# Altium schematic sheet Nucleo_H743ZI.SchDoc: {Наименование}
size 420 x 297 mm; DocumentNumber: НРДЦ.ХХХХХХ.ХХХ ХХ; SheetNumber: 3; SheetTotal: 3; PageSetup: Record=PageOptions|CenterHorizontal=False|CenterVertical=False|PrintScale=0.95|XCorrection=0.00|YCorrection=0.00|PrintKind=1|BorderSize=5000000|LeftOffset=0|BottomOffset=0|Orientation=1|PaperLength=1000|PaperWidth=1000|Scale=100|PaperSource=15|PrintQuality=600|MediaType=1|DitherType=10|PaperKind=A4|PrintScaleMode=1; Rule: PcbType=ProtelPcb
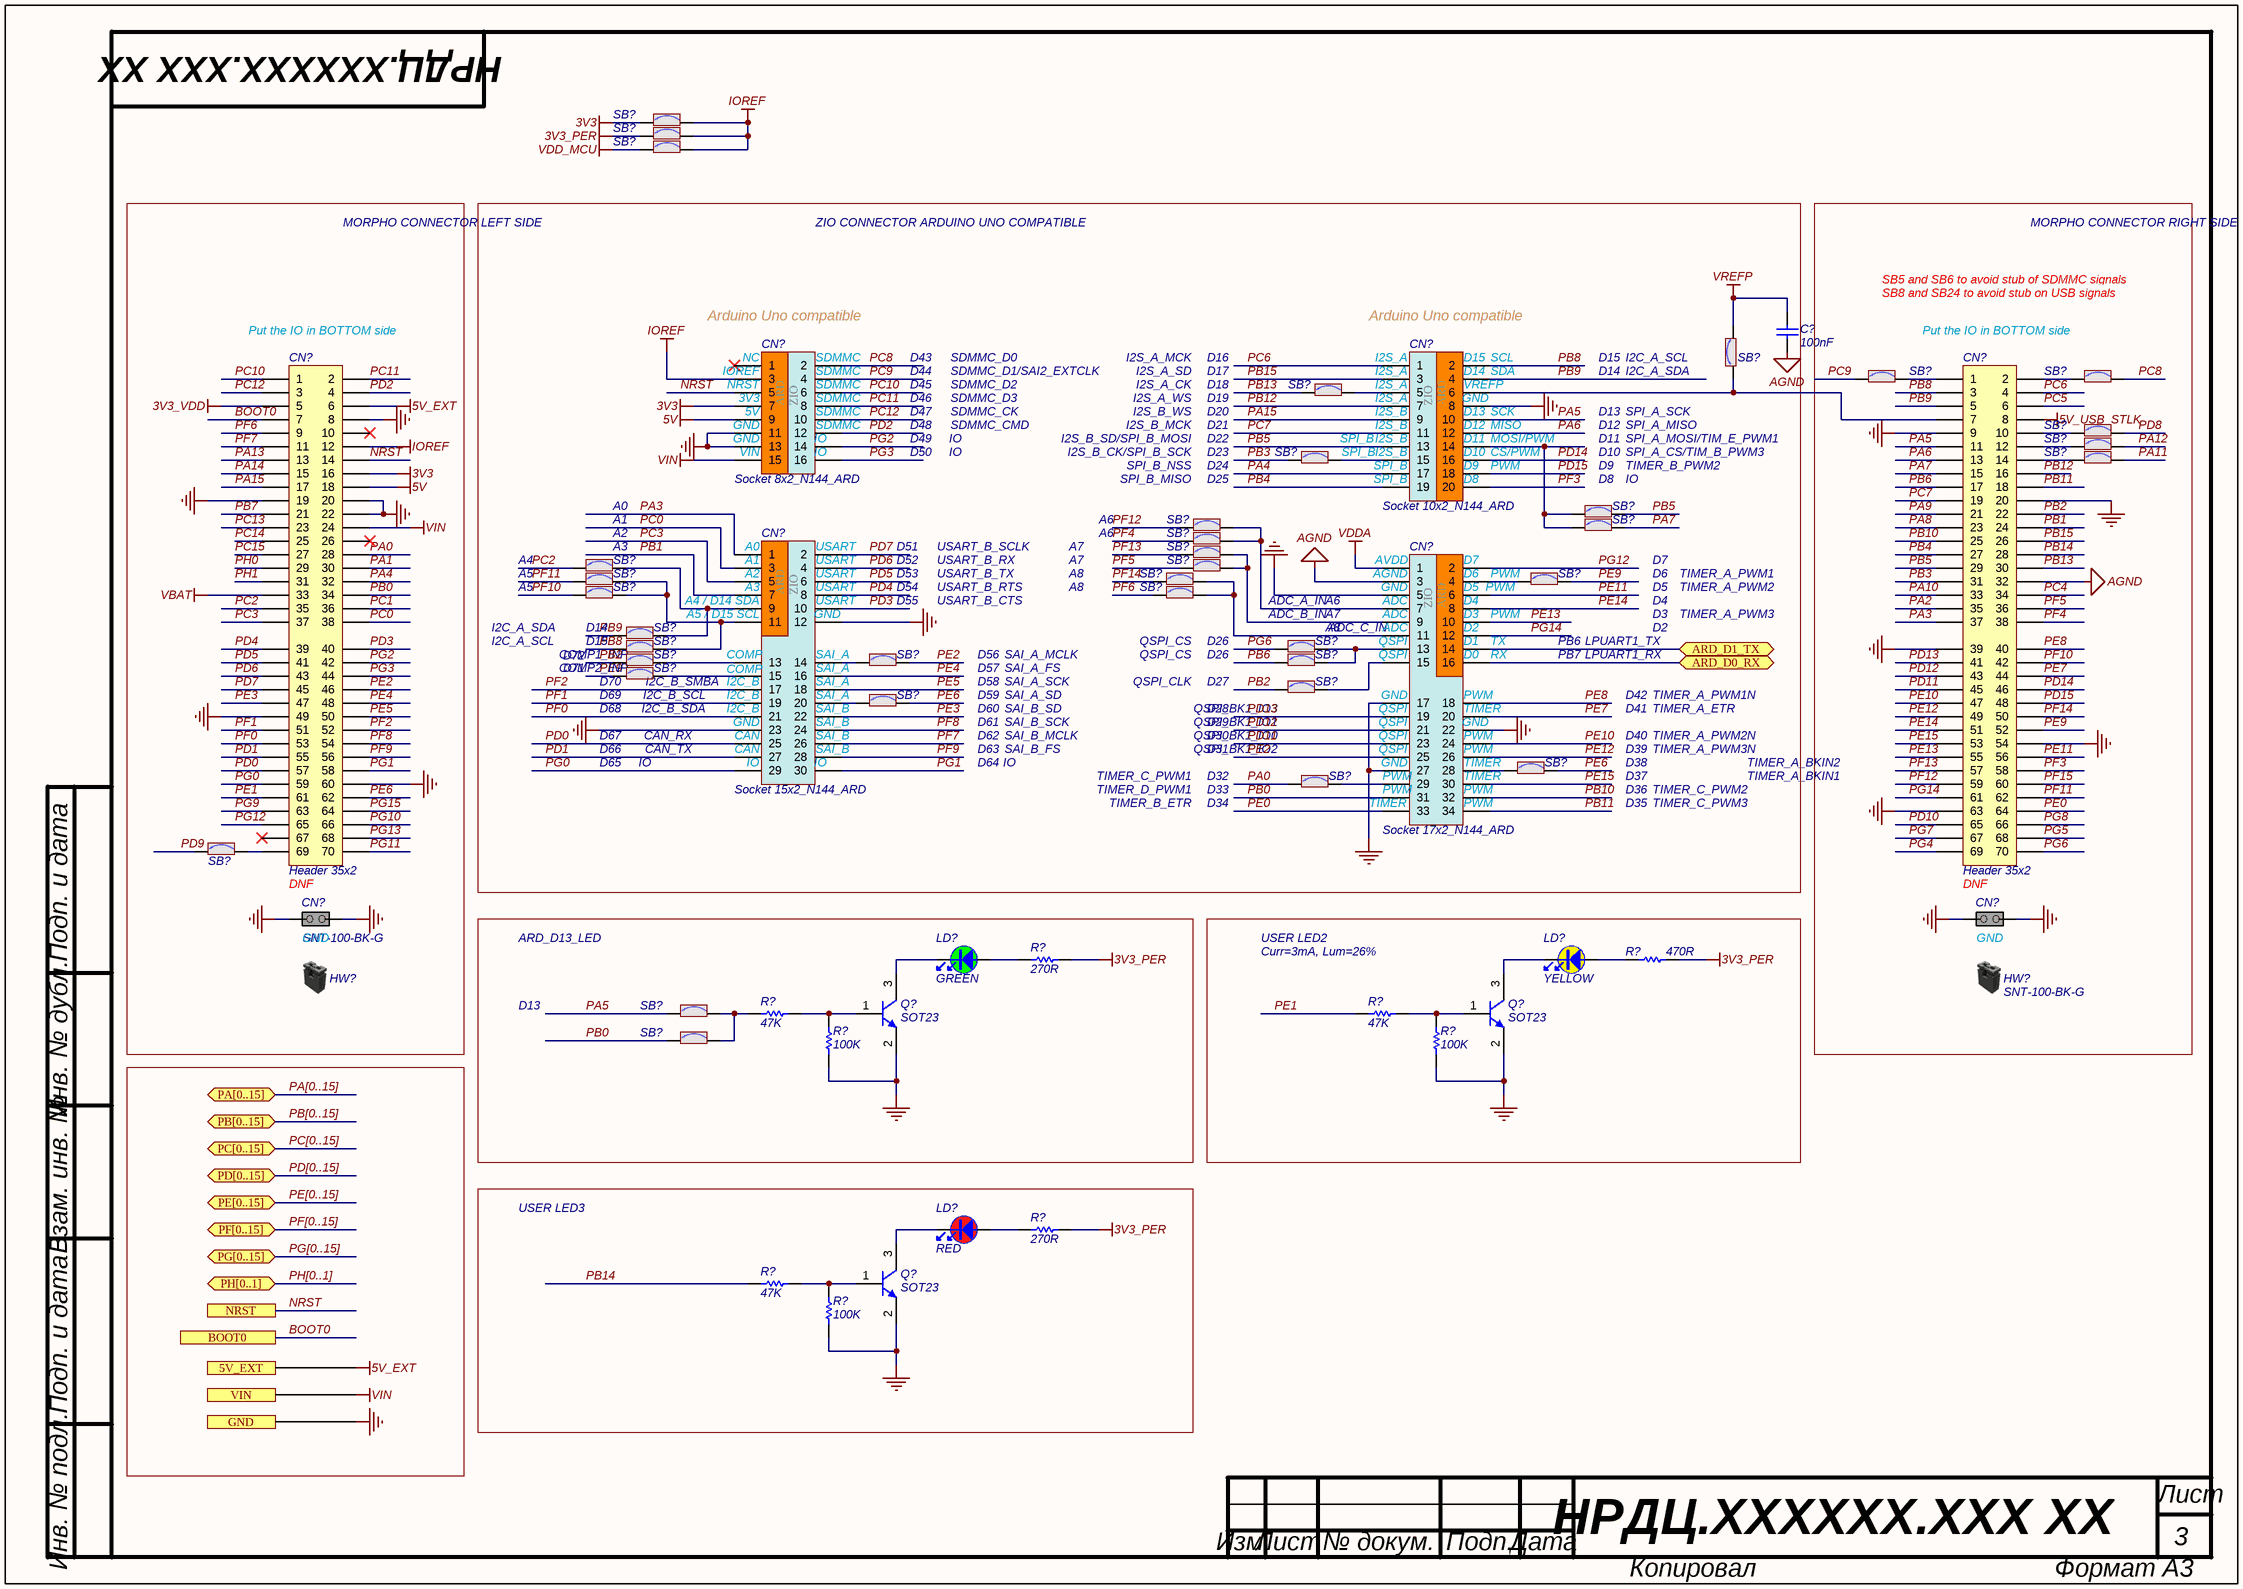
[diagram p0: Nucleo_H743ZI.SchDoc]

## Parts
(Parts that share a designator on the sheet are numbered #1, #2 ... from top to bottom, then left to right.)
C?  value 100nF  [C0603]  (hidden comment: Capacitor)
CN?#1  Socket 8x2_N144_ARD  [CON_SAMTEC_SSW-108-23-X-D_N144_ARD]
CN?#2  Socket 10x2_N144_ARD  [CON_SAMTEC_SSW-110-23-X-D_N144_ARD]
CN?#3  Header 35x2  [CON_SAMTEC_TSW-135-07-X-D]
CN?#4  Header 35x2  [CON_SAMTEC_TSW-135-07-X-D]
CN?#5  Socket 15x2_N144_ARD  [CON_SAMTEC_SSW-115-23-X-D_N144_ARD]
CN?#6  Socket 17x2_N144_ARD  [CON_SAMTEC_SSW-117-23-X-D_N144_ARD]
CN?#7  Jumper_Header 2x1  [CON_SAMTEC_TSW-102-09-X-S]  (value not drawn)
CN?#8  Jumper_Header 2x1  [CON_SAMTEC_TSW-102-09-X-S]  (value not drawn)
HW?#1  value SNT-100-BK-G  (hidden comment: Shunt Black 2.54mm)  (mechanical)
HW?#2  value SNT-100-BK-G  (hidden comment: Shunt Black 2.54mm)  (mechanical)
LD?#1  value GREEN  [LED_0603_OSRAM_LG-Q396-PS-35_GREEN_1A2K_H0P4]  (hidden comment: LED_green)
LD?#2  value YELLOW  [LED_0603_OSRAM_LY-Q396-P1Q2-36_YELLOW_1A2K_H0P4]  (hidden comment: LED_yellow)
LD?#3  value RED  [LED_0603_OSRAM_LS-Q976-NR-1_RED_1A2K_H0P8]  (hidden comment: LED_red)
Q?#1  value SOT23  [NPN_SOT23]  (hidden comment: 9013-SOT23)
Q?#2  value SOT23  [NPN_SOT23]  (hidden comment: 9013-SOT23)
Q?#3  value SOT23  [NPN_SOT23]  (hidden comment: 9013-SOT23)
R?#1  value 270R  [R0402]  (hidden comment: Resistor)
R?#2  value 470R  [R0402]  (hidden comment: Resistor)
R?#3  value 47K  [R0603]  (hidden comment: Resistor)
R?#4  value 47K  [R0603]  (hidden comment: Resistor)
R?#5  value 100K  [R0603]  (hidden comment: Resistor)
R?#6  value 100K  [R0603]  (hidden comment: Resistor)
R?#7  value 270R  [R0402]  (hidden comment: Resistor)
R?#8  value 47K  [R0603]  (hidden comment: Resistor)
R?#9  value 100K  [R0603]  (hidden comment: Resistor)
SB?#1  SB_ON  [SOLDER-BRIDGE_R0603-0R]  (value not drawn)
SB?#2  SB_ON  [SOLDER-BRIDGE_R0603-0R]  (value not drawn)
SB?#3  SB_ON  [SOLDER-BRIDGE_R0603-0R]  (value not drawn)
SB?#4  SB_ON  [SOLDER-BRIDGE_R0603-0R]  (value not drawn)
SB?#5  SB_ON  [SOLDER-BRIDGE_R0603-0R]  (value not drawn)
SB?#6  SB_ON  [SOLDER-BRIDGE_R0603-0R]  (value not drawn)
SB?#7  SB_ON  [SOLDER-BRIDGE_R0603-0R]  (value not drawn)
SB?#8  SB_ON  [SOLDER-BRIDGE_R0402-0R]  (value not drawn)
SB?#9  SB_ON  [SOLDER-BRIDGE_R0603-0R]  (value not drawn)
SB?#10  SB_ON  [SOLDER-BRIDGE_R0603-0R]  (value not drawn)
SB?#11  SB_ON  [SOLDER-BRIDGE_R0603-0R]  (value not drawn)
SB?#12  SB_ON  [SOLDER-BRIDGE_R0603-0R]  (value not drawn)
SB?#13  SB_ON  [SOLDER-BRIDGE_R0402-0R]  (value not drawn)
SB?#14  SB_ON  [SOLDER-BRIDGE_R0603-0R]  (value not drawn)
SB?#15  SB_ON  [SOLDER-BRIDGE_R0402-0R]  (value not drawn)
SB?#16  SB_ON  [SOLDER-BRIDGE_R0402-0R]  (value not drawn)
SB?#17  SB_ON  [SOLDER-BRIDGE_R0402-0R]  (value not drawn)
SB?#18  SB_ON  [SOLDER-BRIDGE_R0402-0R]  (value not drawn)
SB?#19  SB_ON  [SOLDER-BRIDGE_R0402-0R]  (value not drawn)
SB?#20  SB_ON  [SOLDER-BRIDGE_R0402-0R]  (value not drawn)
SB?#21  SB_ON  [SOLDER-BRIDGE_R0402-0R]  (value not drawn)
SB?#22  SB_ON  [SOLDER-BRIDGE_R0402-0R]  (value not drawn)
SB?#23  SB_ON  [SOLDER-BRIDGE_R0402-0R]  (value not drawn)
SB?#24  SB_ON  [SOLDER-BRIDGE_R0402-0R]  (value not drawn)
SB?#25  SB_ON  [SOLDER-BRIDGE_R0402-0R]  (value not drawn)
SB?#26  SB_ON  [SOLDER-BRIDGE_R0402-0R]  (value not drawn)
SB?#27  SB_ON  [SOLDER-BRIDGE_R0402-0R]  (value not drawn)
SB?#28  SB_ON  [SOLDER-BRIDGE_R0402-0R]  (value not drawn)
SB?#29  SB_ON  [SOLDER-BRIDGE_R0402-0R]  (value not drawn)
SB?#30  SB_ON  [SOLDER-BRIDGE_R0402-0R]  (value not drawn)
SB?#31  SB_ON  [SOLDER-BRIDGE_R0402-0R]  (value not drawn)
SB?#32  SB_ON  [SOLDER-BRIDGE_R0402-0R]  (value not drawn)
SB?#33  SB_ON  [SOLDER-BRIDGE_R0402-0R]  (value not drawn)
SB?#34  SB_ON  [SOLDER-BRIDGE_R0402-0R]  (value not drawn)
SB?#35  SB_ON  [SOLDER-BRIDGE_R0402-0R]  (value not drawn)
SB?#36  SB_ON  [SOLDER-BRIDGE_R0603-0R]  (value not drawn)
SB?#37  SB_ON  [SOLDER-BRIDGE_R0603-0R]  (value not drawn)

## Blocks framed on the sheet
USER LED3: LD?#3 Q?#3 R?#7-R?#9

## Ports
5V_EXT, ARD_D0_RX (bidir), ARD_D1_TX (bidir), BOOT0, GND, NRST, PA[0..15] (bidir), PB[0..15] (bidir), PC[0..15] (bidir), PD[0..15] (bidir), PE[0..15] (bidir), PF[0..15] (bidir), PG[0..15] (bidir), PH[0..1] (bidir), VIN

## Nets
3V3: CN?#1.7 CN?#3.16 SB?#1.1
3V3_PER: R?#1.2 R?#2.2 R?#7.2 SB?#2.1
3V3_VDD: CN?#3.5
5V: CN?#1.9 CN?#3.18
5V_EXT: CN?#3.6 ; port 5V_EXT
5V_USB_STLK: CN?#4.8
AGND: C?.1 CN?#4.32 CN?#6.3
GND: CN?#1.11 CN?#1.13 CN?#2.8 CN?#3.8 CN?#3.19 CN?#3.20 CN?#3.22 CN?#3.49 CN?#3.60 CN?#4.9 CN?#4.20 CN?#4.39 CN?#4.54 CN?#4.63 CN?#5.12 CN?#5.23 CN?#6.5 CN?#6.17 CN?#6.22 CN?#6.27 CN?#7.1(COMMON) CN?#7.2(NO) CN?#8.1(COMMON) CN?#8.2(NO) Q?#1.2(E) Q?#2.2(E) Q?#3.2(E) R?#5.1 R?#6.1 R?#9.1 ; port GND
IOREF: CN?#1.3 CN?#3.12 SB?#1.2 SB?#2.2 SB?#3.2
VBAT: CN?#3.33
VDD_MCU: SB?#3.1
VDDA: CN?#6.1
VIN: CN?#1.15 CN?#3.24 ; port VIN
VREFP: C?.2 SB?#4.2
ARD_D0_RX: CN?#6.16 ; port ARD_D0_RX
ARD_D1_TX: CN?#6.14 ; port ARD_D1_TX
BOOT0: CN?#3.7 ; port BOOT0
NRST: CN?#1.5 CN?#3.14 ; port NRST
PA0: CN?#3.28 SB?#34.1
PA1: CN?#3.30
PA2: CN?#4.35
PA3: CN?#4.37 CN?#5.1
PA4: CN?#2.17 CN?#3.32
PA5: CN?#2.10 CN?#4.11 SB?#36.1
PA6: CN?#2.12 CN?#4.13
PA7: CN?#4.15 SB?#14.2
PA8: CN?#4.23
PA9: CN?#4.21
PA10: CN?#4.33
PA11: SB?#11.2
PA12: SB?#9.2
PA13: CN?#3.13
PA14: CN?#3.15
PA15: CN?#2.9 CN?#3.17
PB0: CN?#3.34 CN?#6.31 SB?#37.1
PB1: CN?#4.24 CN?#5.7
PB2: CN?#4.22 SB?#27.1 SB?#31.1
PB3: CN?#4.31 SB?#10.1
PB4: CN?#2.19 CN?#4.27
PB5: CN?#2.13 CN?#4.29 SB?#12.2
PB6: CN?#4.17 SB?#29.1
PB7: CN?#3.21
PB8: CN?#2.2 CN?#4.3 SB?#25.1
PB9: CN?#2.4 CN?#4.5 SB?#24.1
PB10: CN?#4.25 CN?#6.32
PB11: CN?#4.18 CN?#6.34
PB12: CN?#2.7 CN?#4.16
PB13: CN?#4.30 SB?#7.1
PB14: CN?#4.28 R?#8.1
PB15: CN?#2.3 CN?#4.26
PC0: CN?#3.38 CN?#5.3
PC1: CN?#3.36
PC2: CN?#3.35 SB?#17.1
PC3: CN?#3.37 CN?#5.5
PC4: CN?#4.34
PC5: CN?#4.6
PC6: CN?#2.1 CN?#4.4
PC7: CN?#2.11 CN?#4.19
PC8: CN?#1.2 SB?#6.2
PC9: CN?#1.4 SB?#5.1
PC10: CN?#1.6 CN?#3.1
PC11: CN?#1.8 CN?#3.2
PC12: CN?#1.10 CN?#3.3
PC13: CN?#3.23
PC14: CN?#3.25
PC15: CN?#3.27
PD0: CN?#3.57 CN?#5.25
PD1: CN?#3.55 CN?#5.27
PD2: CN?#1.12 CN?#3.4
PD3: CN?#3.40 CN?#5.10
PD4: CN?#3.39 CN?#5.8
PD5: CN?#3.41 CN?#5.6
PD6: CN?#3.43 CN?#5.4
PD7: CN?#3.45 CN?#5.2
PD8: SB?#8.2
PD9: SB?#35.1
PD10: CN?#4.65
PD11: CN?#4.45 CN?#6.23
PD12: CN?#4.43 CN?#6.21
PD13: CN?#4.41 CN?#6.19
PD14: CN?#2.16 CN?#4.46
PD15: CN?#2.18 CN?#4.48
PE0: CN?#4.64 CN?#6.33
PE1: CN?#3.61 R?#4.1
PE2: CN?#3.46 CN?#6.25 SB?#28.2
PE3: CN?#3.47 CN?#5.22
PE4: CN?#3.48 CN?#5.16
PE5: CN?#3.50 CN?#5.18
PE6: CN?#3.62 SB?#32.2 SB?#33.2
PE7: CN?#4.44 CN?#6.20
PE8: CN?#4.40 CN?#6.18
PE9: CN?#4.52 SB?#21.2 SB?#30.1
PE10: CN?#4.47 CN?#6.24
PE11: CN?#4.56 CN?#6.6
PE12: CN?#4.49 CN?#6.26
PE13: CN?#4.55 CN?#6.10
PE14: CN?#4.51 CN?#6.8
PE15: CN?#4.53 CN?#6.30
PF0: CN?#3.53 CN?#5.21
PF1: CN?#3.51 CN?#5.19
PF2: CN?#3.52 CN?#5.17
PF3: CN?#2.20 CN?#4.58
PF4: CN?#4.38 SB?#15.1
PF5: CN?#4.36 SB?#18.1
PF6: CN?#3.9 SB?#23.1
PF7: CN?#3.11 CN?#5.26
PF8: CN?#3.54 CN?#5.24
PF9: CN?#3.56 CN?#5.28
PF10: CN?#4.42 SB?#22.1
PF11: CN?#4.62 SB?#19.1
PF12: CN?#4.59 SB?#13.1
PF13: CN?#4.57 SB?#16.1
PF14: CN?#4.50 SB?#20.1
PF15: CN?#4.60
PG0: CN?#3.59 CN?#5.29
PG1: CN?#3.58 CN?#5.30
PG2: CN?#1.14 CN?#3.42
PG3: CN?#1.16 CN?#3.44
PG4: CN?#4.69
PG5: CN?#4.68
PG6: CN?#4.70 SB?#26.1
PG7: CN?#4.67
PG8: CN?#4.66
PG9: CN?#3.63
PG10: CN?#3.66
PG11: CN?#3.70
PG12: CN?#3.65 CN?#6.2
PG13: CN?#3.68
PG14: CN?#4.61 CN?#6.12
PG15: CN?#3.64
PH0: CN?#3.29
PH1: CN?#3.31
NetCN?#2_5: CN?#2.5 SB?#7.2
NetCN?#2_6: CN?#2.6 CN?#4.7 SB?#4.1
NetCN?#2_14: CN?#2.14 SB?#12.1 SB?#14.1
NetCN?#2_15: CN?#2.15 SB?#10.2
NetCN?#3_69: CN?#3.69 SB?#35.2
NetCN?#4_1: CN?#4.1 SB?#5.2
NetCN?#4_2: CN?#4.2 SB?#6.1
NetCN?#4_10: CN?#4.10 SB?#8.1
NetCN?#4_12: CN?#4.12 SB?#9.1
NetCN?#4_14: CN?#4.14 SB?#11.1
NetCN?#5_9: CN?#5.9 SB?#17.2 SB?#24.2
NetCN?#5_11: CN?#5.11 SB?#19.2 SB?#22.2 SB?#25.2
NetCN?#5_13: CN?#5.13 SB?#27.2
NetCN?#5_14: CN?#5.14 SB?#28.1
NetCN?#5_15: CN?#5.15 SB?#30.2
NetCN?#5_20: CN?#5.20 SB?#32.1
NetCN?#6_4: CN?#6.4 SB?#21.1
NetCN?#6_7: CN?#6.7 SB?#13.2 SB?#15.2
NetCN?#6_9: CN?#6.9 SB?#16.2 SB?#18.2
NetCN?#6_11: CN?#6.11 SB?#20.2 SB?#23.2
NetCN?#6_13: CN?#6.13 SB?#26.2 SB?#29.2
NetCN?#6_15: CN?#6.15 SB?#31.2
NetCN?#6_28: CN?#6.28 SB?#33.1
NetCN?#6_29: CN?#6.29 SB?#34.2
NetLD?#1_1: LD?#1.1 R?#1.1
NetLD?#1_2: LD?#1.2 Q?#1.3(C)
NetLD?#2_1: LD?#2.1 R?#2.1
NetLD?#2_2: LD?#2.2 Q?#2.3(C)
NetLD?#3_1: LD?#3.1 R?#7.1
NetLD?#3_2: LD?#3.2 Q?#3.3(C)
NetQ?#1_1: Q?#1.1(B) R?#3.2 R?#5.2
NetQ?#2_1: Q?#2.1(B) R?#4.2 R?#6.2
NetQ?#3_1: Q?#3.1(B) R?#8.2 R?#9.2
NetR?#3_1: R?#3.1 SB?#36.2 SB?#37.2

Not connected (* = marked no-connect by the designer): CN?#1 1*; CN?#3 10* 26* 67*

## Buses and harness runs
bus PA[0..15] = port PA[0..15]
bus PB[0..15] = port PB[0..15]
bus PC[0..15] = port PC[0..15]
bus PD[0..15] = port PD[0..15]
bus PE[0..15] = port PE[0..15]
bus PF[0..15] = port PF[0..15]
bus PG[0..15] = port PG[0..15]
bus PH[0..1] = port PH[0..1]

## Notes on the sheet
- MORPHO CONNECTOR LEFT SIDE
- ZIO CONNECTOR ARDUINO UNO COMPATIBLE
- MORPHO CONNECTOR RIGHT SIDE
- (near CN?#1) Arduino Uno compatible
- (near CN?#2) Arduino Uno compatible
- SB5 and SB6 to avoid stub of SDMMC signals
- SB8 and SB24 to avoid stub on USB signals
- (near CN?#3) Put the IO in BOTTOM side
- (near CN?#1) NC
- (near CN?#1) IOREF
- (near CN?#1) NRST
- (near CN?#1) SDMMC
- D43
- D44
- D45
- SDMMC_D0
- SDMMC_D1/SAI2_EXTCLK
- SDMMC_D2
- I2S_A_SD
- I2S_A_CK
- I2S_A_MCK
- D16
- D17
- D18
- (near CN?#2) I2S_A
- (near CN?#2) VREFP
- (near CN?#2) D14
- (near CN?#2) D15
- (near CN?#2) SCL
- (near CN?#2) SDA
- D15
- D14
- (near SB?#4) I2C_A_SCL
- (near SB?#4) I2C_A_SDA
- Put the IO in BOTTOM side
- (near CN?#1) 3V3
- (near CN?#1) 5V
- (near CN?#1) GND
- (near CN?#1) VIN
- (near CN?#1) IO
- D46
- D47
- D48
- D49
- D50
- SDMMC_CK
- SDMMC_CMD
- SDMMC_D3
- IO
- I2S_A_WS
- I2S_B_SD/SPI_B_MOSI
- I2S_B_CK/SPI_B_SCK
- I2S_B_WS
- I2S_B_MCK
- D19
- D20
- D21
- D22
- D23
- SPI_B
- (near SB?#10) SPI_B
- (near CN?#2) I2S_B
- (near CN?#2) D10
- (near CN?#2) D11
- (near CN?#2) D12
- (near CN?#2) D13
- (near CN?#2) SCK
- (near CN?#2) GND
- (near CN?#2) MISO
- (near CN?#2) MOSI/PWM
- (near CN?#2) CS/PWM
- D13
- D12
- D11
- D10
- SPI_A_CS/TIM_B_PWM3
- SPI_A_MOSI/TIM_E_PWM1
- SPI_A_SCK
- SPI_A_MISO
- A0
- (near SB?#17) A1
- A6
- (near SB?#13) SPI_B_MISO
- SPI_B_NSS
- D24
- (near SB?#13) D25
- (near CN?#2) SPI_B
- (near CN?#2) D8
- (near CN?#2) D9
- (near CN?#2) PWM
- (near SB?#12) D9
- (near SB?#12) D8
- (near SB?#12) TIMER_B_PWM2
- (near SB?#12) IO
- A4
- A5
- (near SB?#17) A2
- (near SB?#17) A3
- (near CN?#5) A0
- (near CN?#5) A1
- (near CN?#5) A2
- (near CN?#5) A3
- (near CN?#5) USART
- D51
- D52
- D53
- D54
- USART_B_TX
- USART_B_RX
- USART_B_SCLK
- USART_B_RTS
- A7
- A8
- (near CN?#6) GND
- (near CN?#6) AVDD
- (near CN?#6) AGND
- (near CN?#6) D7
- (near CN?#6) D6
- (near CN?#6) D5
- PWM
- D5
- D6
- (near SB?#14) D7
- TIMER_A_PWM1
- TIMER_A_PWM2
- I2C_A_SCL
- (near SB?#22) I2C_A_SDA
- COMP1_INP
- (near SB?#27) D72
- (near SB?#22) D14
- (near SB?#24) D15
- (near CN?#5) COMP
- (near CN?#5) A4 / D14 SDA
- (near CN?#5) A5 / D15 SCL
- (near CN?#5) SAI_A
- (near CN?#5) GND
- D55
- USART_B_CTS
- D56
- SAI_A_MCLK
- (near SB?#23) QSPI_CS
- QSPI_CS
- (near SB?#23) D26
- D26
- (near SB?#26) ADC_A_IN
- (near SB?#26) ADC_B_IN
- (near SB?#26) ADC_C_IN
- (near SB?#26) A7
- (near SB?#26) A8
- (near CN?#6) ADC
- (near CN?#6) QSPI
- (near CN?#6) D2
- (near CN?#6) D4
- (near CN?#6) D3
- (near CN?#6) D1
- (near CN?#6) D0
- (near CN?#6) TX
- (near CN?#6) RX
- PB6
- PB7
- LPUART1_TX
- LPUART1_RX
- D4
- D3
- D2
- TIMER_A_PWM3
- COMP2_INP
- (near SB?#30) D71
- (near SB?#30) D70
- (near SB?#30) D69
- (near SB?#30) D68
- (near SB?#30) I2C_B_SCL
- (near SB?#30) I2C_B_SDA
- (near SB?#30) I2C_B_SMBA
- (near CN?#5) I2C_B
- (near CN?#5) SAI_B
- D57
- D58
- D59
- D60
- D61
- SAI_A_SD
- SAI_A_SCK
- SAI_A_FS
- SAI_B_SD
- SAI_B_SCK
- QSPI_CLK
- QSPI_BK1_IO1
- QSPI_BK1_IO3
- D27
- D28
- D29
- (near CN?#6) TIMER
- (near CN?#6) PWM
- D41
- D42
- TIMER_A_PWM1N
- TIMER_A_ETR
- D67
- D66
- D65
- CAN_TX
- CAN_RX
- (near CN?#5) CAN
- (near CN?#5) IO
- D62
- D63
- D64
- SAI_B_FS
- SAI_B_MCLK
- TIMER_D_PWM1
- TIMER_C_PWM1
- QSPI_BK1_IO0
- QSPI_BK1_IO2
- D30
- D31
- D32
- D33
- D36
- D37
- D38
- D39
- D40
- TIMER_A_PWM2N
- TIMER_A_PWM3N
- TIMER_C_PWM2
- TIMER_A_BKIN1
- TIMER_A_BKIN2
- TIMER_B_ETR
- D34
- D35
- TIMER_C_PWM3
- (near CN?#3) DNF
- (near CN?#4) DNF
- GND
- ARD_D13_LED
- USER LED2
- Curr=3mA, Lum=26%
- Подп. и дата
- Инв. № дубл.
- Взам. инв. №
- Инв. № подл.
- Лист
- Изм.
- № докум.
- Подп.
- Дата
- Копировал
- Формат А3
- (in symbol MCD-01037) ARD; ZIO
- (in symbol MCD-01039) ZIO; ARD
- (in symbol MCD-01040) ARD; ZIO
- (in symbol MCD-01041) ZIO; ARD

## Library data of the parts
C? = MCD-00237: Capacitor, MLCC, 100nF, 6V3, X5R, 10%, 0603, T=0,8mm; Manufacturer_Part_Number: CC0603KRX5R5BB104; Manufacturer: YAGEO; Provided_By: SUBCO; ECCN_US: EAR99; ECCN_EU: NEC; Internal_Part_Number: MCD-00237; Status: Released; Part_Type: Capacitor; Package: C0603; ComponentLink1Description: Datasheet; ComponentLink1URL: http://tunmcdsvn.tun.st.com/Component_Datasheet_Library/Trunk/Capacitors/Yageo_Multilayer_capacitor_X5R_series_100pF_to_100uF
CN?#1 = MCD-01037: Socket, 8x2, 2.54mm, VR, TH, Height 8.51mm/10mm, Low insertion force.; Part_Type: Connector; Manufacturer_Part_Number: SSW-108-23-x-D; Manufacturer: SAMTEC; Provided_By: SUBCO; Internal_Part_Number: MCD-01037; Value: Socket 8x2_N144_ARD; Status: Released; ComponentLink1Description: Datasheet; ComponentLink1URL: http://tunmcdsvn.tun.st.com/Component_Datasheet_Library/Trunk/Connectors/Samtec_SSW-SSQ-series; ECCN_US: n/a; ECCN_EU: n/a
CN?#2 = MCD-01039: Socket, 10x2, 2.54mm, VR, TH, Height 8.51mm/10mm, Low insertion force.; Part_Type: Connector; Manufacturer_Part_Number: SSW-110-23-x-D; Manufacturer: SAMTEC; Provided_By: SUBCO; Internal_Part_Number: MCD-01039; Value: Socket 10x2_N144_ARD; Status: Released; ComponentLink1Description: Datasheet; ComponentLink1URL: http://tunmcdsvn.tun.st.com/Component_Datasheet_Library/Trunk/Connectors/Samtec_SSW-SSQ-series; ECCN_US: n/a; ECCN_EU: n/a
CN?#3 CN?#4 = MCD-01210: Header, 35x2, 2,54mm, VR, TH, Height 5.84mm/2.54mm; Part_Type: Connector; Manufacturer_Part_Number: TSW-135-07-x-D; Manufacturer: SAMTEC; Provided_By: SUBCO; Internal_Part_Number: MCD-01210; Value: Header 35x2; Status: Released; ComponentLink1Description: Datasheet; ComponentLink1URL: http://tunmcdsvn.tun.st.com/Component_Datasheet_Library/Trunk/Connectors/Samtec_TSW-HTSW-series; ECCN_US: n/a; ECCN_EU: n/a
CN?#5 = MCD-01040: Socket, 15x2, 2.54mm, VR, TH, Height 8.51mm/10mm, Low insertion force.; Part_Type: Connector; Manufacturer_Part_Number: SSW-115-23-x-D; Manufacturer: SAMTEC; Provided_By: SUBCO; Internal_Part_Number: MCD-01040; Value: Socket 15x2_N144_ARD; Status: Released; ComponentLink1Description: Datasheet; ComponentLink1URL: http://tunmcdsvn.tun.st.com/Component_Datasheet_Library/Trunk/Connectors/Samtec_SSW-SSQ-series; ECCN_US: n/a; ECCN_EU: n/a
CN?#6 = MCD-01041: Socket, 17x2, 2.54mm, VR, TH, Height 8.51mm/10mm, Low insertion force; Part_Type: Connector; Manufacturer_Part_Number: SSW-117-23-x-D; Manufacturer: SAMTEC; Provided_By: SUBCO; Internal_Part_Number: MCD-01041; Value: Socket 17x2_N144_ARD; Status: Released; ComponentLink1Description: Datasheet; ComponentLink1URL: http://tunmcdsvn.tun.st.com/Component_Datasheet_Library/Trunk/Connectors/Samtec_SSW-SSQ-series; ECCN_US: n/a; ECCN_EU: n/a
CN?#7 CN?#8 = MCD-00214: Header, 2x1, 2,54mm, VR, TH, Height 5.84mm/10.16mm; Manufacturer_Part_Number: TSW-102-09-x-S; Manufacturer: SAMTEC; Part_Type: Connector; Value: Header 2x1 16mm; Provided_By: SUBCO; Internal_Part_Number: MCD-00214; ComponentLink1Description: Datasheet; Status: Released; ComponentLink1URL: http://tunmcdsvn.tun.st.com/Component_Datasheet_Library/Trunk/Connectors/Samtec_TSW-HTSW-series; ECCN_US: n/a; ECCN_EU: n/a
HW?#1 HW?#2 = MCD-00043: SHUNT 2.54mm BLACK; Manufacturer: SAMTEC; Part_Type: Mechanical; Alternate_Manufacturer_Part_Number: 316102S111A; Alternate_Manufacturer: JIUBABA; Provided_By: SUBCO; Internal_Part_Number: MCD-00043; Manufacturer_Part_Number: SNT-100-BK-G; ComponentLink1Description: Datasheet; Status: Released; ComponentLink1URL: http://tunmcdsvn.tun.st.com/Component_Datasheet_Library/Trunk/Connectors/Samtec_Shunt_Jumper_SNT100; ECCN_US: n/a; ECCN_EU: n/a
LD?#1 = MCD-00588: LED Green, 0603 SMD, Forward Voltage Typ=2V, Max=2.5V; Part_Type: Display; Manufacturer_Part_Number: LG Q396-PS-35; Manufacturer: OSRAM OPTO SEMICONDUCTORS; Alternate_Manufacturer_Part_Number: VLMTG1300-GS08; Alternate_Manufacturer: VISHAY SEMICONDUCTOR OPTO DIVISION; Provided_By: SUBCO; Internal_Part_Number: MCD-00588; Status: Released; Package: LED 0603; ComponentLink1Description: Datasheet; ComponentLink1URL: http://tunmcdsvn.tun.st.com/Component_Datasheet_Library/Trunk/Display/OSRAM_LED_GREEN_LG Q396-PS-35; Order_Code_Digikey: LG Q396-PS-35-ND; ECCN_US: n/a; ECCN_EU: n/a
LD?#2 = MCD-01061: LED Yellow, 0603 SMD, Forward Voltage min=1.7V, Typ=2V, Max=2.3V; Part_Type: Display; Manufacturer_Part_Number: LY Q396-P1Q2-36; Manufacturer: OSRAM OPTO SEMICONDUCTORS; Provided_By: SUBCO; Internal_Part_Number: MCD-01061; Status: Released; ComponentLink1Description: Datasheet; ComponentLink1URL: http://tunmcdsvn.tun.st.com/Component_Datasheet_Library/Trunk/Display/OSRAM_LED_0603_YELLOW_LY Q396-P1Q2-36; ECCN_US: n/a; ECCN_EU: n/a
LD?#3 = MCD-00586: LED Red, 0603 SMD, Forward Voltage Typ=2V, Max=2.5V; Part_Type: Display; Manufacturer_Part_Number: LS Q976-NR-1; Manufacturer: OSRAM OPTO SEMICONDUCTORS; Alternate_Manufacturer_Part_Number: VLMS1300-GS08; Alternate_Manufacturer: VISHAY SEMICONDUCTOR OPTO DIVISION; Provided_By: SUBCO; Internal_Part_Number: MCD-00586; Status: Released; Package: LED 0603; ComponentLink1Description: Datasheet; ComponentLink1URL: http://tunmcdsvn.tun.st.com/Component_Datasheet_Library/Trunk/Display/OSRAM_LED_RED_LS Q976-NR-1; Order_Code_Digikey: 475-2512-1-ND; ECCN_US: n/a; ECCN_EU: n/a
Q?#1-Q?#3 = MCD-00073: NPN Bipolar Transistor; Part_Type: IC; Manufacturer_Part_Number: BSR14; Manufacturer: ON SEMICONDUCTOR; Alternate_Manufacturer_Part_Number: MMBT2222ALT1G / MMBT2222ALT3G; Provided_By: SUBCO; ECCN_US: EAR99; ECCN_EU: NEC; Revision: *; Internal_Part_Number: MCD-00073; Status: Released; ComponentLink1Description: Datasheet; ComponentLink1URL: http://tunmcdsvn.tun.st.com/Component_Datasheet_Library/Trunk/IC/NXP_Transistor_BSR14; Alternate_Manufacturer: ON SEMICONDUCTOR
R?#1 R?#7 = MCD-00441: Resistor,270R,0402,1%,1/16W; Manufacturer_Part_Number: RC0402FR-07270RL; Manufacturer: YAGEO; Provided_By: SUBCO; ECCN_US: EAR99; ECCN_EU: NEC; Internal_Part_Number: MCD-00441; Status: Released; Part_Type: Resistor; Package: R0402; ComponentLink1Description: Datasheet; ComponentLink1URL: http://tunmcdsvn.tun.st.com/Component_Datasheet_Library/Trunk/Resistors/Yageo_Resistor_RC0402-series
R?#2 = MCD-00178: Resistor,470R,0402,1%,1/16W; Manufacturer_Part_Number: RC0402FR-07470RL; Manufacturer: YAGEO; Provided_By: SUBCO; ECCN_US: EAR99; ECCN_EU: NEC; Internal_Part_Number: MCD-00178; Status: Released; Part_Type: Resistor; Package: R0402; ComponentLink1Description: Datasheet; ComponentLink1URL: http://tunmcdsvn.tun.st.com/Component_Datasheet_Library/Trunk/Resistors/Yageo_Resistor_RC0402-series
R?#3 R?#4 R?#8 = MCD-00222: Resistor,47K,0603,1%,1/10W; Manufacturer_Part_Number: RC0603FR-0747KL; Manufacturer: YAGEO; Provided_By: SUBCO; ECCN_US: EAR99; ECCN_EU: NEC; Internal_Part_Number: MCD-00222; Status: Released; Part_Type: Resistor; ComponentLink1Description: Datasheet; Package: R0603; ComponentLink1URL: http://tunmcdsvn.tun.st.com/Component_Datasheet_Library/Trunk/Resistors/Yageo_Resistor_RC0603-series
R?#5 R?#6 R?#9 = MCD-00223: Resistor,100K,0603,1%,1/10W; Manufacturer_Part_Number: RC0603FR-07100KL; Manufacturer: YAGEO; Provided_By: SUBCO; ECCN_US: EAR99; ECCN_EU: NEC; Internal_Part_Number: MCD-00223; Status: Released; Part_Type: Resistor; ComponentLink1Description: Datasheet; Package: R0603; ComponentLink1URL: http://tunmcdsvn.tun.st.com/Component_Datasheet_Library/Trunk/Resistors/Yageo_Resistor_RC0603-series
SB?#1-SB?#7 SB?#9-SB?#12 SB?#14 SB?#36 SB?#37 = MCD-00071: Solder Bridge ON; Part_Type: Mechanical; Manufacturer_Part_Number: RC0603JR-070RL; Manufacturer: YAGEO; Provided_By: SUBCO; Internal_Part_Number: MCD-00071; Status: Released; ComponentLink1Description: Datasheet; Package: SB0603; ComponentLink1URL: http://tunmcdsvn.tun.st.com/Component_Datasheet_Library/Trunk/Resistors/Yageo_Resistor_RC0603-series; ECCN_US: n/a; ECCN_EU: n/a
SB?#8 SB?#13 SB?#15-SB?#35 = MCD-01618: Solder Bridge 0402 ON; Part_Type: Mechanical; Manufacturer_Part_Number: RC0402JR-070RL; Manufacturer: YAGEO; Provided_By: SUBCO; Internal_Part_Number: MCD-01618; Status: Footprint available; Package: SB0402; ComponentLink1Description: Datasheet; ComponentLink1URL: http://tunmcdsvn.tun.st.com/Component_Datasheet_Library/Trunk/Resistors/Yageo_Resistor_RC0402-series; ECCN_US: n/a; ECCN_EU: n/a